# Altium schematic sheet ProgrammatorBoard.SchDoc: Название платы
size 209 x 297 mm; ApprovedBy: Рогов; CheckedBy: Фамилия проверяющего; DrawnBy: Фамилия разработчика; DocumentNumber: Введите номер платы + Э3; SheetNumber: пусто если всего 1, в остальных случаях 1; SheetTotal: количество листов; PageSetup: Record=PageOptions|CenterHorizontal=True|CenterVertical=True|PrintScale=0.94|XCorrection=1.00|YCorrection=1.00|PrintKind=2|BorderSize=5000000|LeftOffset=0|BottomOffset=0|Orientation=1|PaperLength=2970|PaperWidth=2100|Scale=100|PaperSource=7|PrintQuality=600|MediaType=1|DitherType=10|PaperKind=A4|PrintScaleMode=1; Title1str: (вторая строка при необходимости); DocumentType: Тип схемы; Format: A4; ImagePath: Введите номер платы
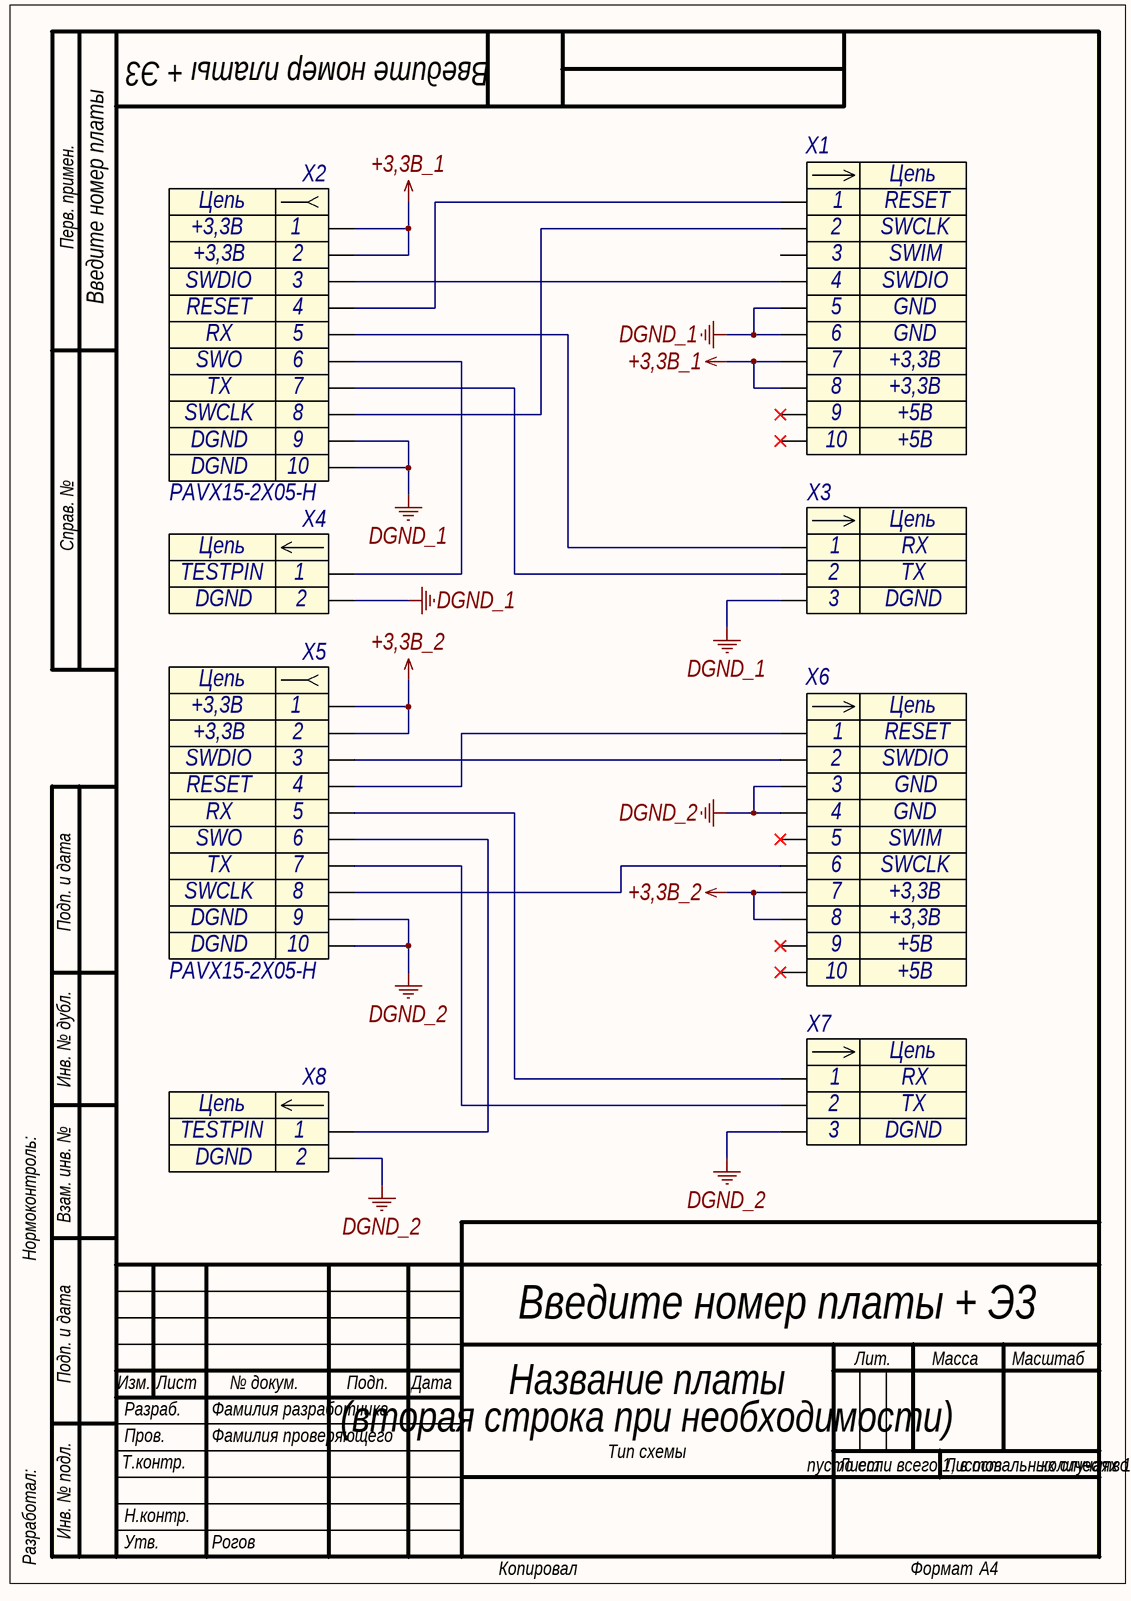
[diagram p0: ProgrammatorBoard.SchDoc]

## Parts
X1  Header_10_plg  [IDC-10MS]  (value not drawn)
X2  Header_10_sct  [PAVX15-2X05-H]  (value not drawn)
X3  Header_3_plg  [PLS-3]  (value not drawn)
X4  (no value)  [PLS-2]
X5  Header_10_sct  [PAVX15-2X05-H]  (value not drawn)
X6  Header_10_plg  [IDC-10MS]  (value not drawn)
X7  Header_3_plg  [PLS-3]  (value not drawn)
X8  (no value)  [PLS-2]

## Nets
+3,3B_1: X1.7 X1.8 X2.1 X2.2
+3,3B_2: X5.1 X5.2 X6.7 X6.8
DGND_1: X1.5 X1.6 X2.9 X2.10 X3.3 X4.2
DGND_2: X5.9 X5.10 X6.3 X6.4 X7.3 X8.2
NetX1_1: X1.1 X2.4
NetX1_2: X1.2 X2.8
NetX1_4: X1.4 X2.3
NetX2_5: X2.5 X3.1
NetX2_6: X2.6 X4.1
NetX2_7: X2.7 X3.2
NetX5_3: X5.3 X6.2
NetX5_4: X5.4 X6.1
NetX5_5: X5.5 X7.1
NetX5_6: X5.6 X8.1
NetX5_7: X5.7 X7.2
NetX5_8: X5.8 X6.6

Not connected (* = marked no-connect by the designer): X1 3 9* 10*; X6 5* 9* 10*

## Notes on the sheet
- Перв. примен.
- Справ. №
- Подп. и дата
- Инв. № дубл.
- Нормоконтроль:
- Взам. инв. №
- Изм.
- Лист
- № докум.
- Подп.
- Дата
- Лит.
- Масса
- Масштаб
- Т.контр.
- Пров.
- Разраб.
- Листов
- Разработал:
- Инв. № подл.
- Н.контр.
- Утв.
- Копировал
- Формат
- (in symbol connect33) Цепь
- (in symbol connect107) Цепь
- (in symbol connect159) Цепь
- (in symbol connect200) Цепь

## Library data of the parts
X1 = connect200: Разъем - 10 конт. вилка; Part Name: BH-10 вилка; Part Number: DS1013-10SSiB1-B-0; Manufacture: Connfly electronic; Contact_1: RESET; Contact_2: SWCLK; Contact_3: SWIM; Contact_4: SWDIO; Contact_5: GND; Etch: 2.54mm; Contact_7: +3,3B; Contact_9: +5B; Contact_6: GND; id: connect200; Contact_8: +3,3B; Contact_10: +5B
X2 X5 = connect107: Разъем - 10 конт. розетка; Part Name: Штыри двухрядные 2x5; Manufacture: Auk Contractors; Contact_1: +3,3B; Contact_3: SWDIO; Contact_4: RESET; Contact_5: RX; Contact_6: SWO; Etch: 1.27mm; Contact_7: TX; Contact_8: SWCLK; Contact_9: DGND; Contact_2: +3,3B; id: connect107; Part Number: PAVX15-2X05-H; Contact_10: DGND
X3 X7 = connect33: Разъем - 3 конт. вилка; Part Number: DS1021-1*3SF112-B; Manufacture: Ningbo connfly electronic; Contact_1: RX; Contact_2: TX; Contact_3: DGND; Etch: 2,54mm; Part Name: PLS-3; id: connect33
X4 X8 = connect159: Разъем - 2 конт. вилка; Contact_1: TESTPIN; Contact_2: DGND; Etch: 2,54mm; Part Name: PLS-2; id: connect159
X6 = connect200: Разъем - 10 конт. вилка; Part Name: BH-10 вилка; Part Number: DS1013-10SSiB1-B-0; Manufacture: Connfly electronic; Contact_1: RESET; Contact_2: SWDIO; Contact_3: GND; Contact_5: SWIM; Contact_6: SWCLK; Etch: 2.54mm; Contact_7: +3,3B; Contact_9: +5B; Contact_4: GND; id: connect200; Contact_8: +3,3B; Contact_10: +5B